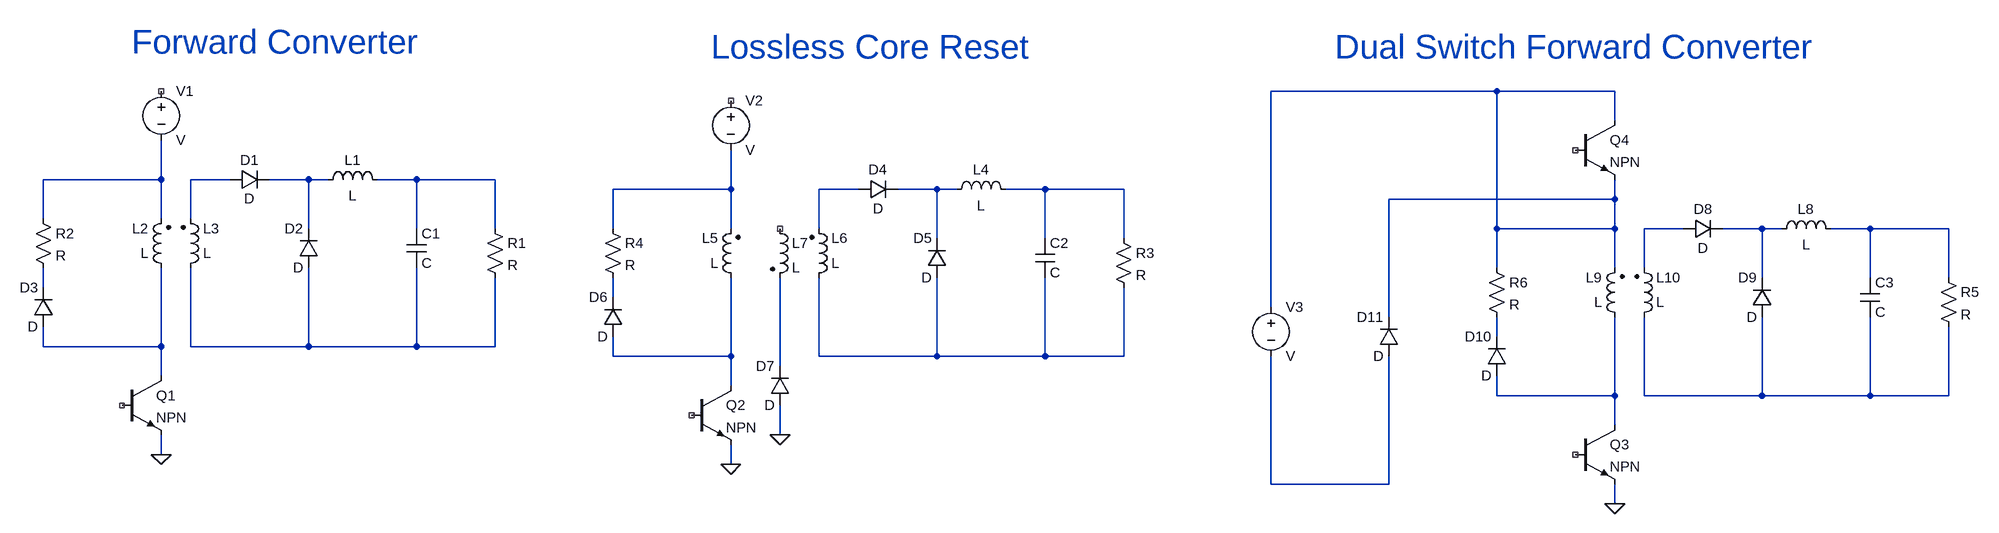
[diagram p0: schematic forward Converter.asc]
forward Converter.asc, the LTspice schematic file:
Version 4
SHEET 1 1784 2580
WIRE 624 -112 256 -112
WIRE 816 -112 624 -112
WIRE 816 -64 816 -112
WIRE -1552 32 -1552 -32
WIRE -1552 32 -1744 32
WIRE -1440 32 -1504 32
WIRE -1312 32 -1376 32
WIRE -1280 32 -1312 32
WIRE -1136 32 -1200 32
WIRE -1008 32 -1136 32
WIRE -624 48 -624 -16
WIRE -624 48 -816 48
WIRE -416 48 -480 48
WIRE -288 48 -352 48
WIRE -256 48 -288 48
WIRE -112 48 -176 48
WIRE 16 48 -112 48
WIRE 816 64 816 32
WIRE 816 64 448 64
WIRE -1744 96 -1744 32
WIRE -1552 96 -1552 32
WIRE -1504 96 -1504 32
WIRE -1312 112 -1312 32
WIRE -1136 112 -1136 32
WIRE -1008 112 -1008 32
WIRE -816 112 -816 48
WIRE -624 112 -624 48
WIRE -480 112 -480 48
WIRE 624 112 624 -112
WIRE 816 112 816 64
WIRE 816 112 624 112
WIRE 928 112 864 112
WIRE 1056 112 992 112
WIRE 1088 112 1056 112
WIRE 1232 112 1168 112
WIRE 1360 112 1232 112
WIRE -288 128 -288 48
WIRE -112 128 -112 48
WIRE 16 128 16 48
WIRE 624 176 624 112
WIRE 816 176 816 112
WIRE 864 176 864 112
WIRE 1056 192 1056 112
WIRE 1232 192 1232 112
WIRE 1360 192 1360 112
WIRE -1744 208 -1744 176
WIRE -816 224 -816 192
WIRE 256 240 256 -112
WIRE 448 256 448 64
WIRE 624 288 624 256
WIRE -1744 304 -1744 272
WIRE -1552 304 -1552 176
WIRE -1552 304 -1744 304
WIRE -1504 304 -1504 176
WIRE -1312 304 -1312 176
WIRE -1312 304 -1504 304
WIRE -1136 304 -1136 176
WIRE -1136 304 -1312 304
WIRE -1008 304 -1008 192
WIRE -1008 304 -1136 304
WIRE -816 320 -816 288
WIRE -624 320 -624 192
WIRE -624 320 -816 320
WIRE -480 320 -480 192
WIRE -288 320 -288 192
WIRE -288 320 -480 320
WIRE -112 320 -112 192
WIRE -112 320 -288 320
WIRE 16 320 16 208
WIRE 16 320 -112 320
WIRE -544 336 -544 192
WIRE -1552 352 -1552 304
WIRE -624 368 -624 320
WIRE 624 384 624 352
WIRE 816 384 816 256
WIRE 816 384 624 384
WIRE 864 384 864 256
WIRE 1056 384 1056 256
WIRE 1056 384 864 384
WIRE 1232 384 1232 256
WIRE 1232 384 1056 384
WIRE 1360 384 1360 272
WIRE 1360 384 1232 384
WIRE 816 432 816 384
WIRE -544 448 -544 400
WIRE -1552 480 -1552 448
WIRE -624 496 -624 464
WIRE 256 528 256 320
WIRE 448 528 448 320
WIRE 448 528 256 528
WIRE 816 560 816 528
FLAG -1552 480 0
FLAG -624 496 0
FLAG -544 448 0
FLAG 816 560 0
SYMBOL diode -1440 48 R270
WINDOW 0 32 32 VTop 2
WINDOW 3 0 32 VBottom 2
SYMATTR InstName D1
SYMBOL diode -1296 176 R180
WINDOW 0 24 64 Left 2
WINDOW 3 24 0 Left 2
SYMATTR InstName D2
SYMBOL ind -1296 48 R270
WINDOW 0 32 56 VTop 2
WINDOW 3 5 56 VBottom 2
SYMATTR InstName L1
SYMBOL ind2 -1536 192 R180
WINDOW 0 36 80 Left 2
WINDOW 3 36 40 Left 2
SYMATTR InstName L2
SYMBOL ind2 -1520 192 M180
WINDOW 0 36 80 Left 2
WINDOW 3 36 40 Left 2
SYMATTR InstName L3
SYMBOL npn -1616 352 R0
SYMATTR InstName Q1
SYMBOL cap -1152 112 R0
SYMATTR InstName C1
SYMBOL res -1024 96 R0
SYMATTR InstName R1
SYMBOL res -1760 80 R0
SYMATTR InstName R2
SYMBOL diode -1728 272 R180
WINDOW 0 24 64 Left 2
WINDOW 3 24 0 Left 2
SYMATTR InstName D3
SYMBOL voltage -1552 -128 R0
SYMATTR InstName V1
SYMBOL diode -416 64 R270
WINDOW 0 32 32 VTop 2
WINDOW 3 0 32 VBottom 2
SYMATTR InstName D4
SYMBOL diode -272 192 R180
WINDOW 0 24 64 Left 2
WINDOW 3 24 0 Left 2
SYMATTR InstName D5
SYMBOL ind -272 64 R270
WINDOW 0 32 56 VTop 2
WINDOW 3 5 56 VBottom 2
SYMATTR InstName L4
SYMBOL ind2 -608 208 R180
WINDOW 0 36 80 Left 2
WINDOW 3 36 40 Left 2
SYMATTR InstName L5
SYMBOL ind2 -496 208 M180
WINDOW 0 36 80 Left 2
WINDOW 3 36 40 Left 2
SYMATTR InstName L6
SYMBOL npn -688 368 R0
SYMATTR InstName Q2
SYMBOL cap -128 128 R0
SYMATTR InstName C2
SYMBOL res 0 112 R0
SYMATTR InstName R3
SYMBOL res -832 96 R0
SYMATTR InstName R4
SYMBOL diode -800 288 R180
WINDOW 0 24 64 Left 2
WINDOW 3 24 0 Left 2
SYMATTR InstName D6
SYMBOL voltage -624 -112 R0
SYMATTR InstName V2
SYMBOL ind2 -560 96 R0
SYMATTR InstName L7
SYMBOL diode -528 400 R180
WINDOW 0 24 64 Left 2
WINDOW 3 24 0 Left 2
SYMATTR InstName D7
SYMBOL diode 928 128 R270
WINDOW 0 32 32 VTop 2
WINDOW 3 0 32 VBottom 2
SYMATTR InstName D8
SYMBOL diode 1072 256 R180
WINDOW 0 24 64 Left 2
WINDOW 3 24 0 Left 2
SYMATTR InstName D9
SYMBOL ind 1072 128 R270
WINDOW 0 32 56 VTop 2
WINDOW 3 5 56 VBottom 2
SYMATTR InstName L8
SYMBOL ind2 832 272 R180
WINDOW 0 36 80 Left 2
WINDOW 3 36 40 Left 2
SYMATTR InstName L9
SYMBOL ind2 848 272 M180
WINDOW 0 36 80 Left 2
WINDOW 3 36 40 Left 2
SYMATTR InstName L10
SYMBOL npn 752 432 R0
SYMATTR InstName Q3
SYMBOL cap 1216 192 R0
SYMATTR InstName C3
SYMBOL res 1344 176 R0
SYMATTR InstName R5
SYMBOL res 608 160 R0
SYMATTR InstName R6
SYMBOL diode 640 352 R180
WINDOW 0 24 64 Left 2
WINDOW 3 24 0 Left 2
SYMATTR InstName D10
SYMBOL voltage 256 224 R0
SYMATTR InstName V3
SYMBOL npn 752 -64 R0
SYMATTR InstName Q4
SYMBOL diode 464 320 R180
WINDOW 0 24 64 Left 2
WINDOW 3 24 0 Left 2
SYMATTR InstName D11
TEXT -1600 -192 Left 5 ;Forward Converter
TEXT 360 -184 Left 5 ;Dual Switch Forward Converter
TEXT -656 -184 Left 5 ;Lossless Core Reset

The netlist it stands for:
* forward Converter.asc
D1 N003 N004 D
D2 N017 N004 D
L1 N004 N005 L
L2 N016 N002 L
L3 N017 N003 L
Q1 N016 NC_01 0 0 NPN
C1 N005 N017 C
R1 N005 N017 R
R2 N002 N013 R
D3 N016 N013 D
V1 NC_02 N002 V
D4 N007 N008 D
D5 N019 N008 D
L4 N008 N009 L
L5 N018 N006 L
L6 N019 N007 L
Q2 N018 NC_03 0 0 NPN
C2 N009 N019 C
R3 N009 N019 R
R4 N006 N014 R
D6 N018 N014 D
V2 NC_04 N006 V
L7 NC_05 N020 L
D7 0 N020 D
D8 N010 N011 D
D9 N022 N011 D
L8 N011 N012 L
L9 N021 N001 L
L10 N022 N010 L
Q3 N021 NC_06 0 0 NPN
C3 N012 N022 C
R5 N012 N022 R
R6 N001 N015 R
D10 N021 N015 D
V3 N001 N023 V
Q4 N001 NC_07 N001 0 NPN
D11 N023 N001 D
.model D D
.lib standard.dio
.model NPN NPN
.model PNP PNP
.lib standard.bjt
* Forward Converter
* Dual Switch Forward Converter
* Lossless Core Reset
.backanno
.end